# Altium schematic sheet 5V Enable.SchDoc: 5V Enable Switch
size A4
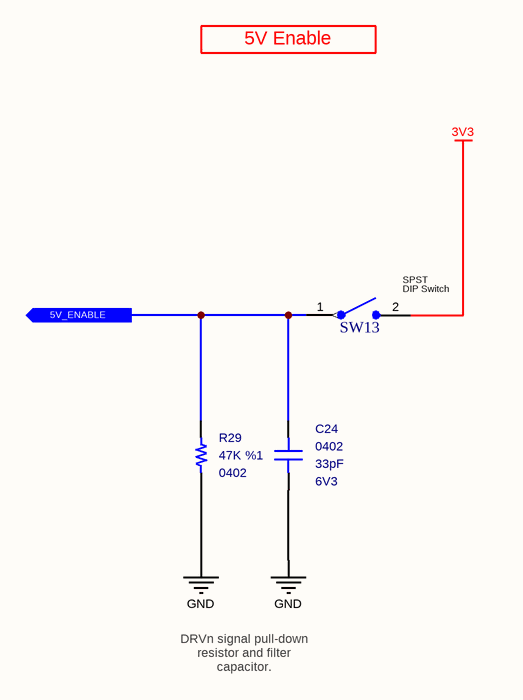
[diagram p0: 5V Enable.SchDoc]

## Parts
C24  value 33pF  Case: 0402  Voltage: 6V3  [CAPACITOR_0402]  (hidden comment: Multilayer Ceramic Capacitor)
R29  value 47K  Tolerance: %1  Case: 0402  [RESISTOR_0402]  (hidden comment: Thick Film Resistor)
SW13  DIP Switch  [DS04-254-2-01BK-SMT-TR]  (value not drawn)

## Ports
5V_ENABLE (out)

## Nets
3V3: SW13.2(NO)
GND: C24.1 R29.1
5V_ENABLE: C24.2 R29.2 SW13.1(COM) ; port 5V_ENABLE

## Notes on the sheet
- 5V Enable
- DRVn signal pull-down resistor and filter capacitor.
- Title
- Size:
- Date:
- A4
- Number:
- Time:
- Revision:
- Sheet
- of
- File:
- (in symbol Switch - DIP Switch (1 Pole)) SPST

## Library data of the parts
C24 = Capacitor - 33pF [0402-6V3]: Capacitor - 33pF [0402] (Ceramic); Manufacturer_Name: Kemet; Manufacturer_Part_Number: C0402C330J9RACAUTO; Dielectric: X7R; Tolerance: 10%; Height: 0.5mm; Mouser_Part_Number: 80-C0402C330J9RAUTO; Maximum Operating Temperature: +125; Minimum Operating Temperature: -55; ROHS: Yes; ComponentLink1Description: DataSheet; ComponentLink1URL: https://api.kemet.com/component-edge/download/datasheet/C0402C330J9RACAUTO.pdf; ComponentLink2Description: Mouser; ComponentLink2URL: https://www.mouser.com/Search/Refine.aspx?Keyword=80-C0402C330J9RAUTO; Supplier 1: Mouser; Supplier Part Number 1: 80-C0402C330J9RAUTO
R29 = Resistor - 47K: Thick Film Resistors - SMD 1/16 W 47 Kohms 1%; Manufacturer_Name: Vishay; Manufacturer_Part_Number: CRCW040247K0FKED; Height: 0.4mm; Mouser_Part_Number: 71-CRCW0402-47K-E3; ComponentLink1Description: DataSheet; ComponentLink1URL: https://www.mouser.com.tr/datasheet/2/427/dcrcwe3-1762152.pdf; ComponentLink2Description: Mouser; ComponentLink2URL: https://www.mouser.com.tr/ProductDetail/Vishay-Dale/CRCW040247K0FKED?qs=sGAEpiMZZMu61qfTUdNhG2DpbjADlD3GL%252B3h1elTxqU%3D; Supplier 1: Mouser; Supplier 2: Digi-Key; Supplier Part Number 1: 71-CRCW040247K0FKEDH; Supplier Part Number 2: 541-47.0KYCT-ND
SW13 = Switch - DIP Switch (1 Pole): DIP Switches/SIP Switches DIP Switch, SPST, 2.54 pitch, flat actuator, SMT, Tape and reel, 1 position, Black; Manufacturer Name: CUI Devices; Manufacturer Part Number: DS04-254-2-01BK-SMT-TR; Mouser Part Number: 490-DS04254201BK-STR; ComponentLink1Description: DataSheet; ComponentLink1URL: https://www.mouser.com.tr/datasheet/2/670/ds04_254_smt-1777718.pdf; ComponentLink2Description: Mouser; ComponentLink2URL: https://www.mouser.com.tr/ProductDetail/CUI-Devices/DS04-254-2-01BK-SMT-TR/?qs=%2Fha2pyFadujy0kBXqTx%252B7K4ZqypoI1xcyUu3ptD5LL%252BAwZdjUHFG%252BXP1ryAUxmHU; Supplier 1: RSComponents; Supplier 2: Arrow Electronics; Supplier 3: Farnell; Supplier 4: Newark; Supplier 5: Digi-Key; Supplier Part Number 1: 6820986; Supplier Part Number 2: A6S-1104-H; Supplier Part Number 3: 1960892; Supplier Part Number 4: 83T2298; Supplier Part Number 5: Z5187-ND